# EAGLE schematic USB Multiplicator 2023 (EAGLE 9.6.2)
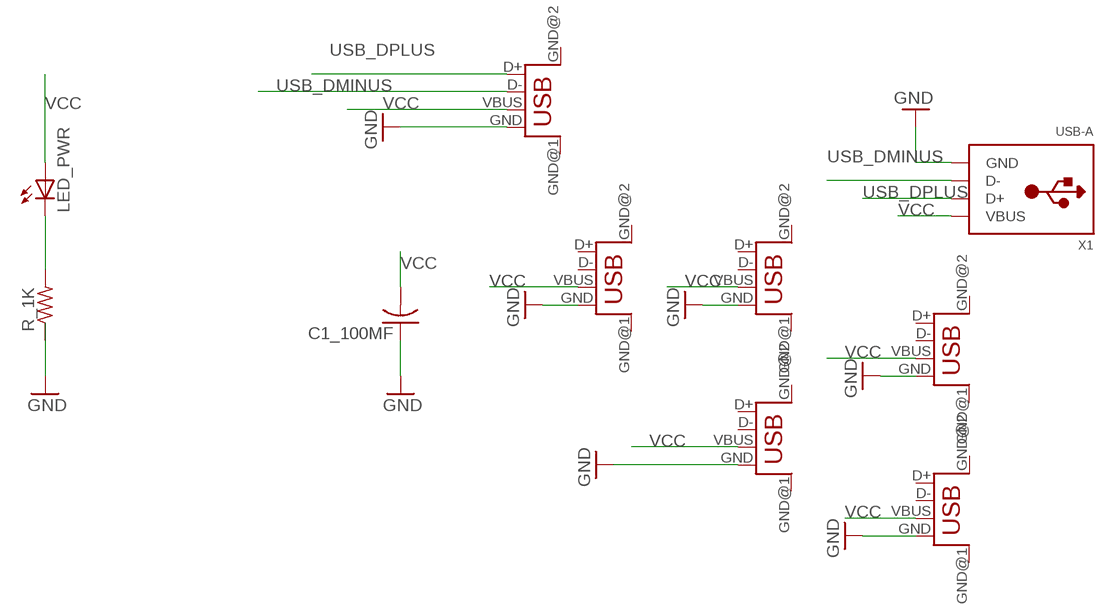
[diagram p0: schematic, sheet 1]

## Parts
C1_100MF  C-US025-030X050  [C025-030X050]
LED_PWR  LEDSMT1206  [1206]
R_1K  R-US_R1206  [R1206]
USB_OUT_2  USB  [USB-FEMALE-A-PTH]
USB_OUT_3  USB  [USB-FEMALE-A-PTH]
USB_OUT_4  USB  [USB-FEMALE-A-PTH]
USB_OUT_5  USB  [USB-FEMALE-A-PTH]
USB_OUT_6  USB  [USB-FEMALE-A-PTH]
USB_OUT_WITH_DATA_1  USB  [USB-FEMALE-A-PTH]
X1  USB-A  [MOLEX_480371000]

## Nets
GND: C1_100MF.1 R_1K.1 USB_OUT_2.GND USB_OUT_3.GND USB_OUT_4.GND USB_OUT_5.GND USB_OUT_6.GND USB_OUT_WITH_DATA_1.GND X1.4(GND)
N$5: LED_PWR.C R_1K.2
USB_DMINUS: USB_OUT_WITH_DATA_1.D- X1.2(D-)
USB_DPLUS: USB_OUT_WITH_DATA_1.D+ X1.3(D+)
VCC: C1_100MF.2 LED_PWR.A USB_OUT_2.VBUS USB_OUT_3.VBUS USB_OUT_4.VBUS USB_OUT_5.VBUS USB_OUT_6.VBUS USB_OUT_WITH_DATA_1.VBUS X1.1(VBUS)
Unconnected: USB_OUT_2.D+ USB_OUT_2.D- USB_OUT_2.GND@1(GND) USB_OUT_2.GND@2(GND) USB_OUT_3.D+ USB_OUT_3.D- USB_OUT_3.GND@1(GND) USB_OUT_3.GND@2(GND) USB_OUT_4.D+ USB_OUT_4.D- USB_OUT_4.GND@1(GND) USB_OUT_4.GND@2(GND) USB_OUT_5.D+ USB_OUT_5.D- USB_OUT_5.GND@1(GND) USB_OUT_5.GND@2(GND) USB_OUT_6.D+ USB_OUT_6.D- USB_OUT_6.GND@1(GND) USB_OUT_6.GND@2(GND) USB_OUT_WITH_DATA_1.GND@1(GND) USB_OUT_WITH_DATA_1.GND@2(GND)

## Library data of the parts
C1_100MF = adafruit:C-US: CAPACITOR, American symbol
LED_PWR = adafruit:LED: LED OSRAM: - CHIPLED LG R971, LG N971, LY N971, LG Q971, LY Q971, LO R971, LY R971 LH N974, LH R974 LS Q976, LO Q976, LY Q976 LO Q996 - Hyper CHIPLED LW Q18S LB Q993, LB Q99A, LB R99A - SideLED LS A670, LO A670, LY A670, LG A670, LP A670 LB A673, LV A673, LT A673, LW A673 LH A674 LY A675 LS A676, LA A676, LO A676, LY A676, LW A676 LS A679, LY A679, LG A679 - Hyper Micro SIDELED® LS Y876, LA Y876, LO Y876, LY Y876 LT Y87S - SmartLED LW L88C, LW L88S LB L89C, LB L89S, LG L890 LS L89K, LO L89K, LY L89K LS L896, LA L896, LO L896, LY L896 - TOPLED LS T670, LO T670, LY T670, LG T670, LP T670 LSG T670, LSP T670, LSY T670, LOP T670, LYG T670 LG T671, LOG T671, LSG T671 LB T673, LV T673, LT T673, LW T673 LH T674 LS T676, LA T676, LO T676, LY T676, LB T676, LH T676, LSB T676, LW T676 LB T67C, LV T67C, LT T67C, LS T67K, LO T67K, LY T67K, LW E67C LS E67B, LA E67B, LO E67B, LY E67B, LB E67C, LV E67C, LT E67C LW T67C LS T679, LY T679, LG T679 LS T770, LO T770, LY T770, LG T770, LP T770 LB T773, LV T773, LT T773, LW T773 LH T774 LS E675, LA E675, LY E675, LS T675 LS T776, LA T776, LO T776, LY T776, LB T776 LHGB T686 LT T68C, LB T68C - Hyper Mini TOPLED® LB M676 - Mini TOPLED Santana® LG M470 LS M47K, LO M47K, LY M47K Source: http://www.osram.convergy.de/
R_1K = adafruit:R-US_: RESISTOR, American symbol
USB_OUT_2-USB_OUT_6 USB_OUT_WITH_DATA_1 = STUNTAZ:USB: USB Connectors USB-FEMALE-A-PTH: Through hole Female Type A Connector
X1 = adafruit:USB-A: USB type A 'plug' Used for things that can directly connect to a USB port, say USB key